# EasyEDA Pro project 读卡器V1.0.eprj

# Schematic Schematic1
Create Date: 2023-06-12; Page Name: P1; Project Name: 读卡器V1.0; Schematic Name: Schematic1; Update Date: 2023-06-30
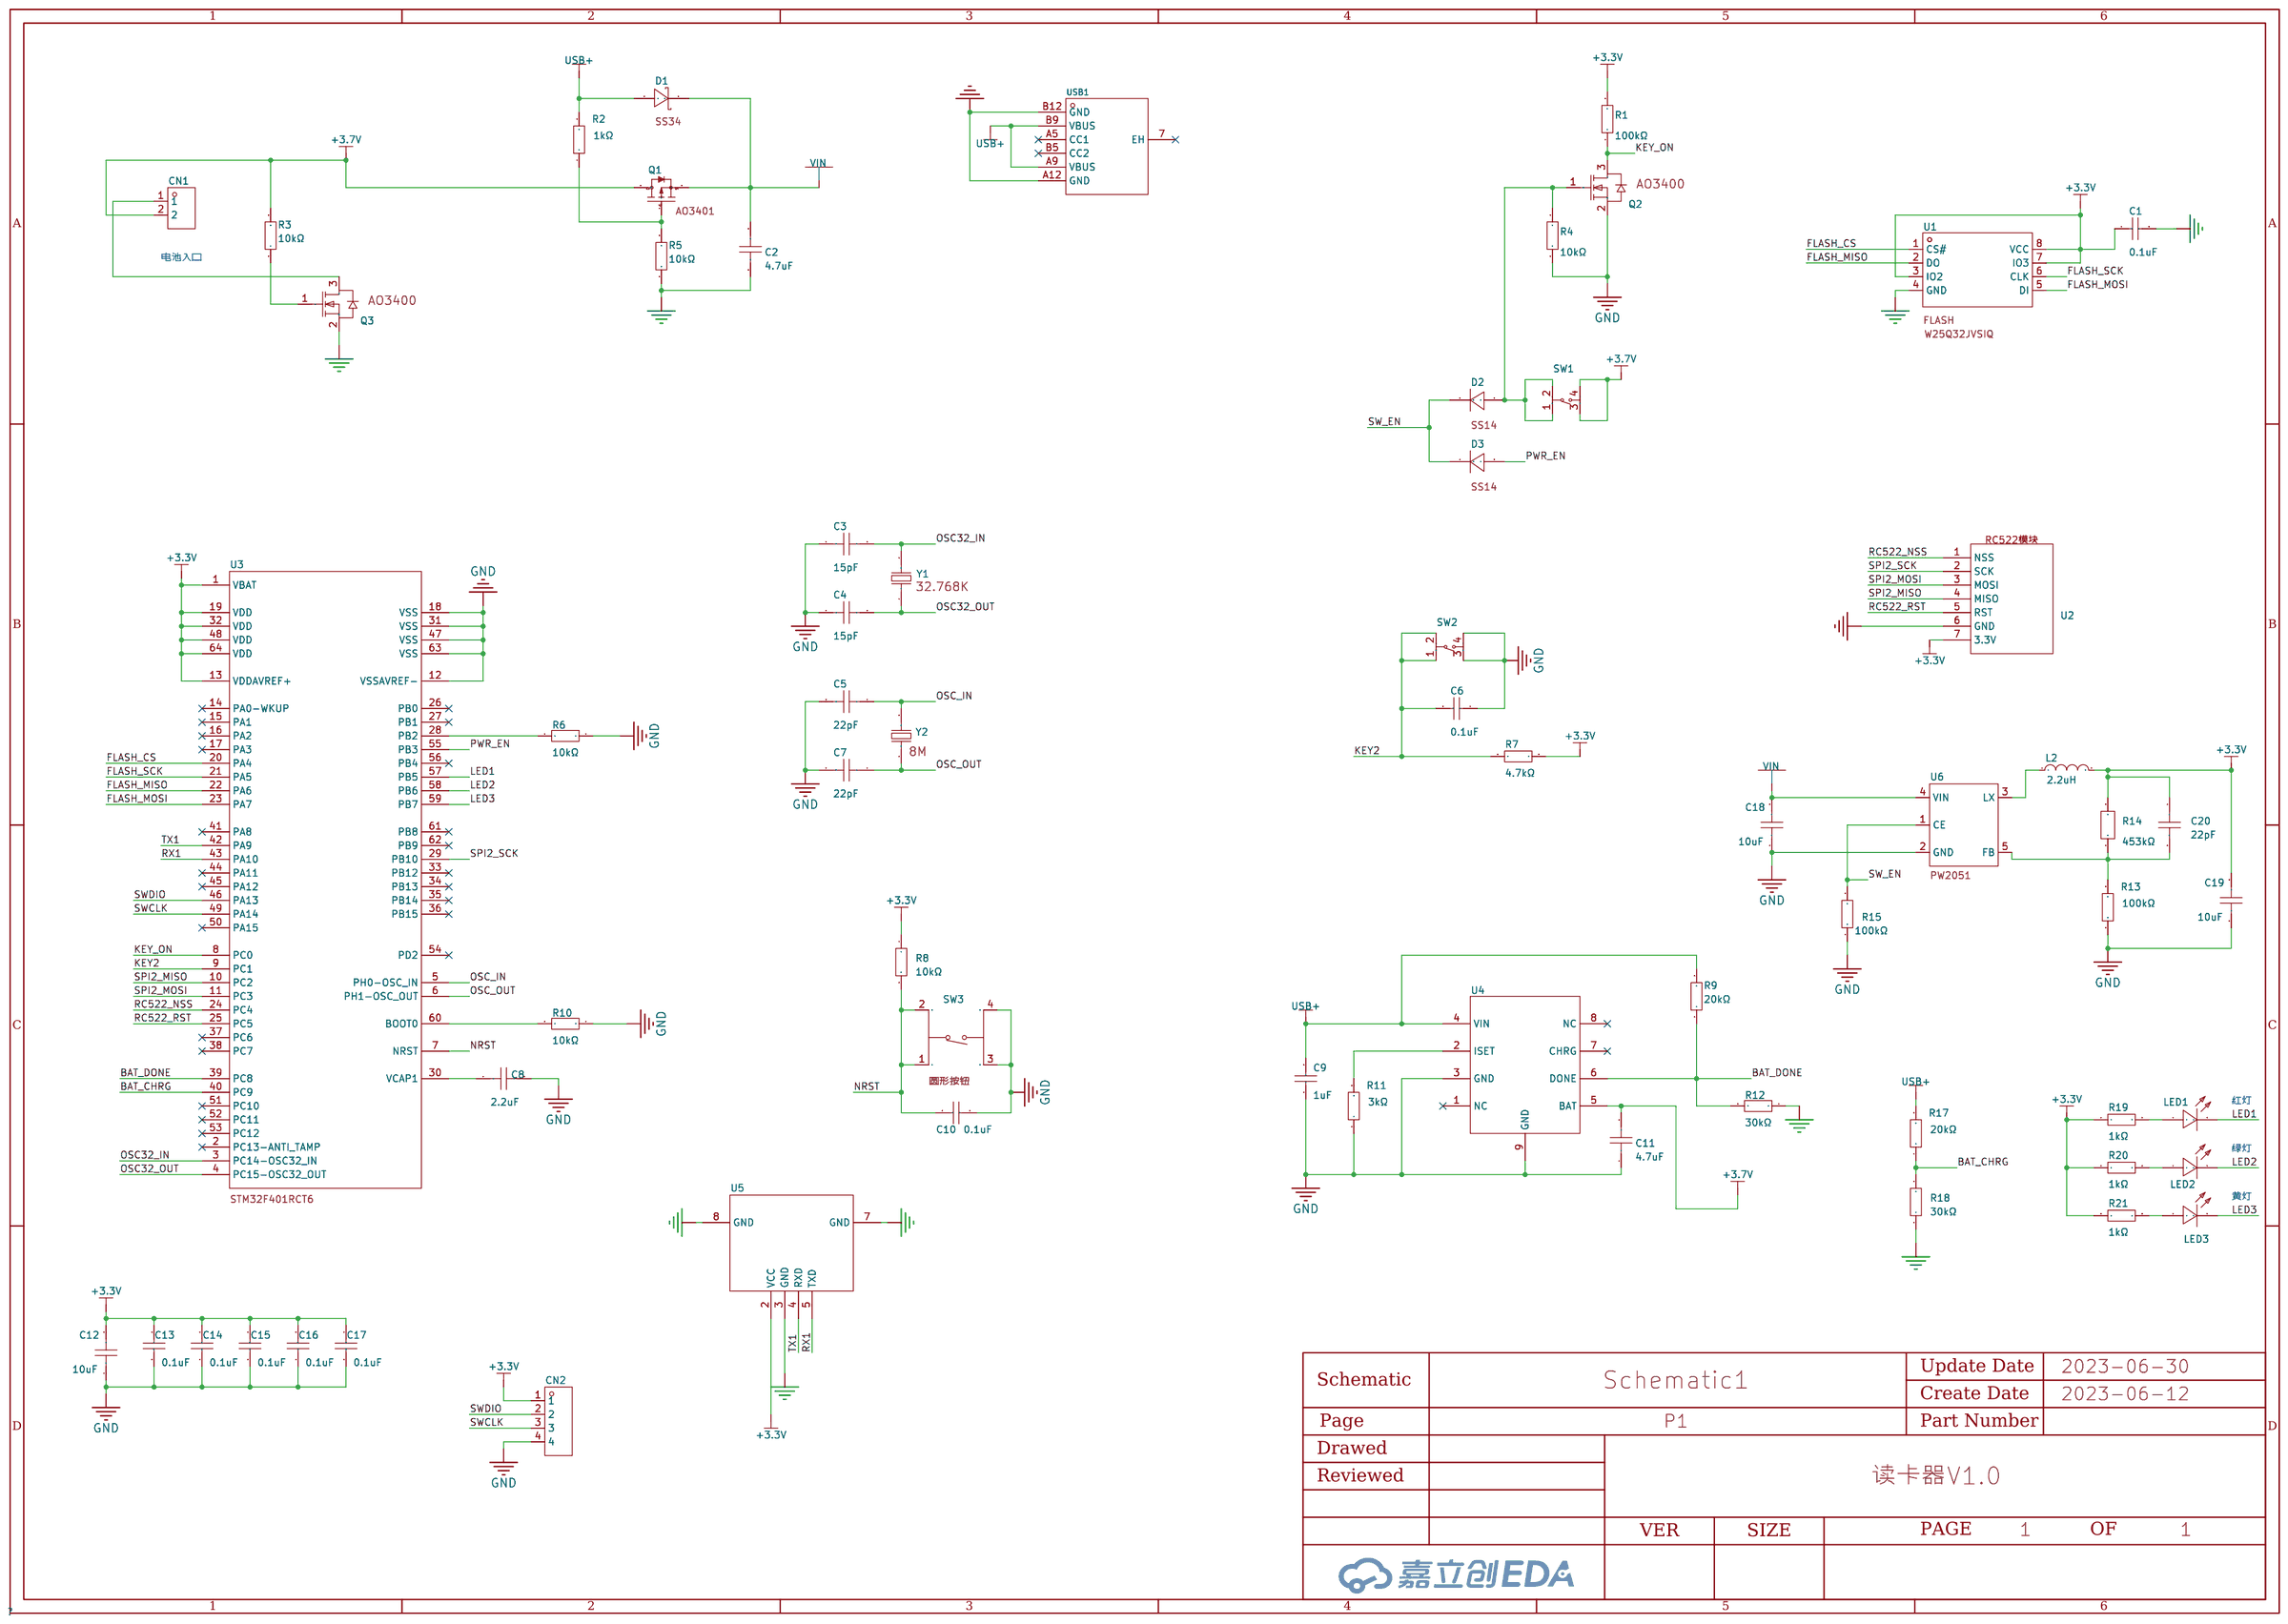
[diagram p0: schematic sheet]

## Parts
C1  0.1uF  [C0603]
C2  4.7uF  [C0603]
C3  15pF  [C0603]
C4  15pF  [C0603]
C5  22pF  [C0603]
C6  0.1uF  [C0603]
C7  22pF  [C0603]
C8  2.2uF  [C0603]
C9  1uF  [C0603]
C10  0.1uF  [C0603]
C11  4.7uF  [C0603]
C12  10uF  [C0603]
C13  0.1uF  [C0603]
C14  0.1uF  [C0603]
C15  0.1uF  [C0603]
C16  0.1uF  [C0603]
C17  0.1uF  [C0603]
C18  10uF  [C0603]
C19  10uF  [C0603]
C20  22pF  [C0603]
CN1  HDGC2501WR-2P  [CONN-TH_2P-P2.50_HDGC2501WR-2P]
CN2  1125-1104G0R138C002  [HDR-TH_4P-P2.54-H-M-W9.4]
D1  -  [DO-214AC_L4.3-W2.7-LS5.3-RD]
D2  SS14  [SMA_L4.3-W2.6-LS5.2-RD]
D3  SS14  [SMA_L4.3-W2.6-LS5.2-RD]
L2  2.2uH  [IND-SMD_L4.0-W4.0_0.47UH04209.5A]
LED1  TLMG1100-GS08  [LED0603-R-RD_GREEN]
LED2  TLMG1100-GS08  [LED0603-R-RD_GREEN]
LED3  TLMG1100-GS08  [LED0603-R-RD_GREEN]
Q1  -  [SOT-23-3_L2.9-W1.3-P1.90-LS2.4-BR]
Q2  AO3400  [SOT-23_L2.9-W1.3-P1.90-LS2.4-BR]
Q3  AO3400  [SOT-23_L2.9-W1.3-P1.90-LS2.4-BR]
R1  100kΩ  [R0603]
R2  1kΩ  [R0603]
R3  10kΩ  [R0603]
R4  10kΩ  [R0603]
R5  10kΩ  [R0603]
R6  10kΩ  [R0603]
R7  4.7kΩ  [R0603]
R8  10kΩ  [R0603]
R9  20kΩ  [R0603]
R10  10kΩ  [R0603]
R11  3kΩ  [R0603]
R12  30kΩ  [R0603]
R13  100kΩ  [R0603]
R14  453kΩ  [R0603]
R15  100kΩ  [R0603]
R17  20kΩ  [R0603]
R18  30kΩ  [R0603]
R19  1kΩ  [R0603]
R20  1kΩ  [R0603]
R21  1kΩ  [R0603]
SW1  -  [按钮开关]
SW2  -  [按钮开关]
SW3  1TS001G-2700-1500-CT  [SW-SMD_4P-L5.1-W5.1-P3.70-LS6.5-TL-2]
U1  -  [SOIC-8_L5.3-W5.3-P1.27-LS8.0-BL]
U2  -  [MFRC522mini]
U3  STM32F401RCT6  [LQFP-64_L10.0-W10.0-P0.50-LS12.0-BL]
U4  -  [PW4056]
U5  -  [GC2400-TC010R]
U6  -  [PW2051]
USB1  TYPE-C 6P(073)  [TYPE-C-SMD_TYPE-C-6P]
Y1  -  [3215]
Y2  -  [5032]

## Library data of the parts
C1 C6 C10 C13-C17 = 0603B104K101CT: 容值:100nF;精度:±10%;额定电压:100V;温度系数:X7R;; LCSC Part Name: 100nF ±10% 100V; Supplier Part: C116838; Manufacturer: 华新科(Walsin); Supplier Footprint: 0603; JLCPCB Part Class: Extended Part; Datasheet: https://atta.szlcsc.com/upload/public/pdf/source/20190709/C116838_F1A9F4B47B8E555AD45D8607B90A094B.pdf; Supplier: LCSC; Tolerance: ±10%; Voltage Rated: 100V; Temperature Coefficient: X7R
C2 C11 = 0603X475M160NT: 容值:4.7uF;精度:±20%;额定电压:16V;温度系数:X5R;; LCSC Part Name: 4.7uF ±20% 16V; Supplier Part: C417282; Manufacturer: FH(风华); Supplier Footprint: 0603; JLCPCB Part Class: Extended Part; Datasheet: https://atta.szlcsc.com/upload/public/pdf/source/20190828/C417282_9FA89336CC150C49D68906F9E844F6E8.pdf; Supplier: LCSC; Tolerance: ±20%; Voltage Rated: 16V; Temperature Coefficient: X5R
C3 C4 = 0603CG150J500NT: 容值:15pF;精度:±5%;额定电压:50V;温度系数:C0G;; LCSC Part Name: 15pF ±5% 50V; Supplier Part: C91703; Manufacturer: FH(风华); Supplier Footprint: 0603; JLCPCB Part Class: Extended Part; Datasheet: https://atta.szlcsc.com/upload/public/pdf/source/20170105/1483610779016.pdf; Supplier: LCSC; Tolerance: ±5%; Voltage Rated: 50V; Temperature Coefficient: C0G
C5 C7 C20 = 0603CG220F500NT: 容值:22pF;精度:±1%;额定电压:50V;温度系数:C0G;; LCSC Part Name: 22pF ±1% 50V; Supplier Part: C190086; Manufacturer: FH(风华); Supplier Footprint: 0603; JLCPCB Part Class: Extended Part; Datasheet: https://atta.szlcsc.com/upload/public/pdf/source/20180403/C190086_AE2857A36C77ED36CE0DF753AD1C79C3.pdf; Supplier: LCSC; Tolerance: ±1%; Voltage Rated: 50V; Temperature Coefficient: C0G
C8 = 0603B225K160CT: 容值:2.2uF;精度:±10%;额定电压:16V;温度系数:X7R;; LCSC Part Name: 2.2uF ±10% 16V; Supplier Part: C525501; Manufacturer: 华新科(Walsin); Supplier Footprint: 0603; JLCPCB Part Class: Extended Part; Datasheet: https://atta.szlcsc.com/upload/public/pdf/source/20191217/C469650_84AD5C6F618CF4AC0C6D987F2E8FE6F8.pdf; Supplier: LCSC; Tolerance: ±10%; Voltage Rated: 16V; Temperature Coefficient: X7R
C9 = 0603F105M250NT: 容值:1uF;精度:±20%;额定电压:25V;温度系数:Y5V;; LCSC Part Name: 1uF ±20% 25V; Supplier Part: C36577; Manufacturer: FH(风华); Supplier Footprint: 0603; JLCPCB Part Class: Extended Part; Datasheet: https://atta.szlcsc.com/upload/public/pdf/source/20170923/C36577_1506149443286988738.pdf; Supplier: LCSC; Tolerance: ±20%; Voltage Rated: 25V; Temperature Coefficient: Y5V
C12 C18 C19 = 0603X106M100CT: 容值:10uF;精度:±20%;额定电压:10V;温度系数:X5R;; LCSC Part Name: 10uF ±20% 10V; Supplier Part: C89283; Manufacturer: 华新科(Walsin); Supplier Footprint: 0603; JLCPCB Part Class: Extended Part; Datasheet: https://atta.szlcsc.com/upload/public/pdf/source/20161226/1482720147964.pdf; Supplier: LCSC; Tolerance: ±20%; Voltage Rated: 10V; Temperature Coefficient: X5R
CN1 = HDGC2501WR-2P: LCSC Part Name: XH2.5弯针 2P; Supplier Part: C5175255; Manufacturer: HDGC(华德共创); Supplier Footprint: 弯插,P=2.5mm; JLCPCB Part Class: Extended Part; Datasheet: https://atta.szlcsc.com/upload/public/pdf/source/20220916/C1717F8E2C78083BF9D63A459D48AEE1.pdf; Supplier: LCSC
CN2 = 1125-1104G0R138C002: 排数:单排;总PIN位数:4;间距:2.54mm;插针结构:1x4P;行距:2.54mm;安装类型:弯插;圆针/方针:方针;额定电流:3A;额定电压:320V;配合针长度:6mm;塑高:2.5mm;端接针长度:-;触头材质:黄铜;触头镀层:金;工作温度范围:-40~+105;颜色:黑色;; LCSC Part Name: 2.54mm 1x4P 弯插 方针; Supplier Part: C721443; Manufacturer: Wcon(维峰电子); Supplier Footprint: 弯插,P=2.54mm; JLCPCB Part Class: Extended Part; Datasheet: https://atta.szlcsc.com/upload/public/pdf/source/20200817/C721441_9C294CE567E7CA2BF1A06D224BABC3D8.pdf; Supplier: LCSC; Number of Rows: 单排; Number of Pins: 4; Pitch: 2.54mm; Pin Structure: 1x4P; Row Spacing: 2.54mm; Mounting Type: 弯插; Circluar Pins/Square Pins: 方针; Current Rating (Max): 3A; Voltage Rating (Max): 320V; Length of Mating Pin: 6mm; Insulation Height: 2.5mm; Contact Material: 黄铜; Contact Plating: 金; Operating Temperature Range: -40~+105; Color: 黑色
D1 = SS34_C8678: 直流反向耐压(Vr):40V;平均整流电流(Io):3A;正向压降(Vf):550mV@3A;; LCSC Part Name: 40V 3A 550mV@3A; Supplier Part: C8678; Manufacturer: MDD; Manufacturer Part: SS34; Supplier Footprint: SMA(DO-214AC); JLCPCB Part Class: Basic Part; Datasheet: https://atta.szlcsc.com/upload/public/pdf/source/20210506/C15874_5BDBC70F665BA444FCE0210303DB2A89.pdf; Supplier: LCSC; Reverse Voltage (Vr): 40V; Average Rectified Current (Io): 3A; Forward Voltage (Vf@If): 550mV@3A
D2 D3 = SS14A: 直流反向耐压(Vr):40V;平均整流电流(Io):1A;正向压降(Vf):500mV@1A;; LCSC Part Name: 40V 1A 500mV@1A; Supplier Part: C211770; Manufacturer: YANGJIE(扬杰); Supplier Footprint: SMA(DO-214AC); JLCPCB Part Class: Extended Part; Datasheet: https://atta.szlcsc.com/upload/public/pdf/source/20180504/C211770_627C435F34E9C107E4A4301F69D28675.pdf; Supplier: LCSC; Reverse Voltage (Vr): 40V; Average Rectified Current (Io): 1A; Forward Voltage (Vf@If): 500mV@1A
L2 = 2.2uh3a电感: 电感值:2.2uH;精度:±20%;额定电流:3A;直流电阻(DCR):-;; Rated Current: 3A; Supplier: LCSC; Supplier Part: C438930; Supplier Footprint: SMD; LCSC Part Name: 2.2uH ±20% 3A; Tolerance: ±20%; Manufacturer: Cybermax(思博科技); Manufacturer Part: CMLO0420H2R2MTT
LED1-LED3 = TLMG1100-GS08: 照明颜色:普绿/黄绿;色温 - CCT（K）:-;主波长/色坐标:570nm;; LCSC Part Name: 普绿/黄绿 0603; Supplier Part: C241891; Manufacturer: VISHAY(威世); Supplier Footprint: 0603; JLCPCB Part Class: Extended Part; Datasheet: https://atta.szlcsc.com/upload/public/pdf/source/20180719/C241891_3C76D4DD30CDE57601F75DEAAAECA69D.pdf; Supplier: LCSC; Mounting Type: 表面贴装; Illumination Color: 普绿/黄绿; Luminous Intensity (IF=20mA): 35mcd; Dominant Wavelength / Coordinate rank: 570nm
Q1 = AO3401_C181091: 类型:P沟道;漏源电压(Vdss):30V;连续漏极电流(Id):4.2A;功率(Pd):350mW;导通电阻(RDS(on)@Vgs,Id):65mΩ@10V,4.2A;阈值电压(Vgs(th)@Id):1.3V@250A;; LCSC Part Name: P沟道 30V 4.2A; Supplier Part: C181091; Manufacturer: Hottech(合科泰); Manufacturer Part: AO3401; Supplier Footprint: SOT-23(SOT-23-3); JLCPCB Part Class: Extended Part; Datasheet: https://atta.szlcsc.com/upload/public/pdf/source/20180131/C181091_15173931948391329220.pdf; Supplier: LCSC; Type: P沟道; Drain Source Voltage (Vdss): 30V; Continuous Drain Current (Id): 4.2A; Power Dissipation (Pd): 350mW; Drain Source On Resistance (RDS(on)@Vgs,Id): 65mΩ@10V,4.2A; Gate Threshold Voltage (Vgs(th)@Id): 1.3V@250A
Q2 Q3 = AO3400: 类型:N沟道;漏源电压(Vdss):30V;连续漏极电流(Id):5.8A;功率(Pd):1.5W;导通电阻(RDS(on)@Vgs,Id):35mΩ@10V,5.8A;阈值电压(Vgs(th)@Id):1.2V@250uA;栅极电荷(Qg@Vgs):-;输入电容(Ciss@Vds):1050pF@15V;反向传输电容(Crss@Vds):77pF@15V;工作温度:+150@(Tj);; LCSC Part Name: N沟道 30V 5.8A; Supplier Part: C2938367; Manufacturer: GOODWORK(固得沃克); Supplier Footprint: SOT23; JLCPCB Part Class: Extended Part; Datasheet: https://atta.szlcsc.com/upload/public/pdf/source/20211229/1DE691E24B5B31BB262C463D0489A9AB.pdf; Supplier: LCSC; Type: N沟道; Drain Source Voltage (Vdss): 30V; Continuous Drain Current (Id): 5.8A; Power Dissipation (Pd): 1.5W; Drain Source On Resistance (RDS(on)@Vgs,Id): 35mΩ@10V,5.8A; Gate Threshold Voltage (Vgs(th)@Id): 1.2V@250uA; Input Capacitance (Ciss@Vds): 1050pF@15V; Reverse Transfer Capacitance (Crss@Vds): 77pF@15V; Operating Temperature: +150@(Tj)
R1 = MCT06030C1003FP500: 电阻类型:薄膜电阻;阻值:100kΩ;精度:±1%;功率:100mW;温度系数:±50ppm/K;最大工作电压:75V;工作温度范围:-55~+125;; LCSC Part Name: 100kΩ ±1%; Supplier Part: C161805; Manufacturer: VISHAY(威世); Supplier Footprint: 0603; JLCPCB Part Class: Extended Part; Datasheet: https://atta.szlcsc.com/upload/public/pdf/source/20180125/C161805_15168649470331302834.pdf; Supplier: LCSC; Type: 薄膜电阻; Tolerance: ±1%; Power(Watts): 100mW; Temperature Coefficient: ±50ppm/K; Overload Voltage (Max): 75V; Operating Temperature Range: -55~+125
R2 = TR0603B1K00P0525Z: 电阻类型:薄膜电阻;阻值:1kΩ;精度:±0.1%;功率:100mW;温度系数:±25ppm/;最大工作电压:75V;工作温度范围:-55~+155;; LCSC Part Name: 1kΩ ±0.1%; Supplier Part: C188364; Manufacturer: EVER OHMS(天二科技); Supplier Footprint: 0603; JLCPCB Part Class: Extended Part; Datasheet: https://atta.szlcsc.com/upload/public/pdf/source/20190415/C188364_2560310032FA915A7069B8237DA8774F.pdf; Supplier: LCSC; Type: 薄膜电阻; Tolerance: ±0.1%; Power(Watts): 100mW; Temperature Coefficient: ±25ppm/; Overload Voltage (Max): 75V; Operating Temperature Range: -55~+155
R3-R6 R8 R10 = SY0603JN10KP: 阻值:10kΩ;精度:±5%;功率:1/16W;温度系数:±100ppm/;; LCSC Part Name: 10kΩ ±5%; Supplier Part: C380762; Manufacturer: SANYEAR(叁叶源); Supplier Footprint: 0603; JLCPCB Part Class: Extended Part; Datasheet: https://atta.szlcsc.com/upload/public/pdf/source/20190402/C380762_D09B63EB8DF4AE0F44268631C04132BC.pdf; Supplier: LCSC; Tolerance: ±5%; Power(Watts): 1/16W; Temperature Coefficient: ±100ppm/
R7 = RMC 0603 4K7 F N: 阻值:4.7kΩ;精度:±1%;功率:0.1W;; LCSC Part Name: 4.7kΩ ±1%; Supplier Part: C269713; Manufacturer: Tyohm(幸亚电阻); Supplier Footprint: 0603; JLCPCB Part Class: Extended Part; Datasheet: https://atta.szlcsc.com/upload/public/pdf/source/20190115/C269713_06B12CBF45628C37C65359B185ED7F9D.pdf; Supplier: LCSC; Tolerance: ±1%; Power(Watts): 0.1W
R9 = RC0603DR-0720KL: 电阻类型:厚膜电阻;阻值:20kΩ;精度:±0.5%;功率:100mW;温度系数:±100ppm/;最大工作电压:75V;工作温度范围:-55~+155;; LCSC Part Name: 20kΩ ±0.5%; Supplier Part: C137817; Manufacturer: YAGEO(国巨); Supplier Footprint: 0603; JLCPCB Part Class: Extended Part; Datasheet: https://atta.szlcsc.com/upload/public/pdf/source/20171106/C137817_15099606819651093946.pdf; Supplier: LCSC; Type: 厚膜电阻; Tolerance: ±0.5%; Power(Watts): 100mW; Temperature Coefficient: ±100ppm/; Overload Voltage (Max): 75V; Operating Temperature Range: -55~+155
R11 = 0603WAJ0302T5E: 电阻类型:厚膜电阻;阻值:3kΩ;精度:±5%;功率:1/10W;温度系数:±100ppm/;最大工作电压:75V;工作温度范围:-55~+155;; LCSC Part Name: 3kΩ ±5%; Supplier Part: C25597; Manufacturer: UNI-ROYAL(厚声); Supplier Footprint: 0603; JLCPCB Part Class: Extended Part; Datasheet: https://atta.szlcsc.com/upload/public/pdf/source/20200306/C422600_1E6D84923E4A46A82E41ADD87F860B5C.pdf; Supplier: LCSC; Type: 厚膜电阻; Tolerance: ±5%; Power(Watts): 1/10W; Temperature Coefficient: ±100ppm/; Overload Voltage (Max): 75V; Operating Temperature Range: -55~+155
R12 = AC0603FR-0730KL: 电阻类型:厚膜电阻;阻值:30kΩ;精度:±1%;功率:100mW;温度系数:±100ppm/;最大工作电压:75V;工作温度范围:-55~+155;; LCSC Part Name: 30kΩ ±1%; Supplier Part: C144670; Manufacturer: YAGEO(国巨); Supplier Footprint: 0603; JLCPCB Part Class: Extended Part; Datasheet: https://atta.szlcsc.com/upload/public/pdf/source/20171225/C144670_15141880418861202957.pdf; Supplier: LCSC; Type: 厚膜电阻; Tolerance: ±1%; Power(Watts): 100mW; Temperature Coefficient: ±100ppm/; Overload Voltage (Max): 75V; Operating Temperature Range: -55~+155
R13 R15 = 0603WAF1003T5E: 电阻类型:厚膜电阻;阻值:100kΩ;精度:±1%;功率:100mW;; LCSC Part Name: 100kΩ ±1% 100mW; Supplier Part: C25803; Manufacturer: UNI-ROYAL(厚声); Supplier Footprint: 0603; JLCPCB Part Class: Basic Part; Datasheet: https://atta.szlcsc.com/upload/public/pdf/source/20200306/C422600_1E6D84923E4A46A82E41ADD87F860B5C.pdf; Supplier: LCSC; Type: 厚膜电阻; Tolerance: ±1%; Power(Watts): 100mW; Temperature Coefficient: ±100ppm/; Overload Voltage (Max): 75V; Operating Temperature Range: -55~+155
R14 = RC0603FR-07453KL: 电阻类型:厚膜电阻;阻值:453kΩ;精度:±1%;功率:100mW;; LCSC Part Name: 453kΩ ±1% 100mW; Supplier Part: C273765; Manufacturer: YAGEO(国巨); Supplier Footprint: 0603; JLCPCB Part Class: Extended Part; Datasheet: https://atta.szlcsc.com/upload/public/pdf/source/20191125/C273765_7C421A3A285B90E1F65B5105C399ED72.pdf; Supplier: LCSC; Type: 厚膜电阻; Tolerance: ±1%; Power(Watts): 100mW; Temperature Coefficient: ±100ppm/; Overload Voltage (Max): 75V; Operating Temperature Range: -55~+155
R17 = 0603WAF2002T5E: 电阻类型:厚膜电阻;阻值:20kΩ;精度:±1%;功率:100mW;; LCSC Part Name: 20kΩ ±1% 100mW; Supplier Part: C4184; Manufacturer: UNI-ROYAL(厚声); Supplier Footprint: 0603; JLCPCB Part Class: Basic Part; Datasheet: https://atta.szlcsc.com/upload/public/pdf/source/20200306/C422600_1E6D84923E4A46A82E41ADD87F860B5C.pdf; Supplier: LCSC; Type: 厚膜电阻; Tolerance: ±1%; Power(Watts): 100mW; Temperature Coefficient: ±100ppm/; Overload Voltage (Max): 75V; Operating Temperature Range: -55~+155
R18 = 0603WAF3002T5E: 电阻类型:厚膜电阻;阻值:30kΩ;精度:±1%;功率:100mW;; LCSC Part Name: 30kΩ ±1% 100mW; Supplier Part: C22984; Manufacturer: UNI-ROYAL(厚声); Supplier Footprint: 0603; JLCPCB Part Class: Basic Part; Datasheet: https://atta.szlcsc.com/upload/public/pdf/source/20200306/C422600_1E6D84923E4A46A82E41ADD87F860B5C.pdf; Supplier: LCSC; Type: 厚膜电阻; Tolerance: ±1%; Power(Watts): 100mW; Temperature Coefficient: ±100ppm/; Overload Voltage (Max): 75V; Operating Temperature Range: -55~+155
R19-R21 = 0603WAF5100T5E: 电阻类型:厚膜电阻;阻值:510Ω;精度:±1%;功率:100mW;; LCSC Part Name: 510Ω ±1% 100mW; Supplier Part: C23193; Manufacturer: UNI-ROYAL(厚声); Supplier Footprint: 0603; JLCPCB Part Class: Basic Part; Datasheet: https://atta.szlcsc.com/upload/public/pdf/source/20200306/C422600_1E6D84923E4A46A82E41ADD87F860B5C.pdf; Supplier: LCSC; Type: 厚膜电阻; Tolerance: ±1%; Power(Watts): 100mW; Temperature Coefficient: ±100ppm/; Overload Voltage (Max): 75V; Operating Temperature Range: -55~+155
SW1 SW2 = 按键开关
SW3 = 1TS001G-2700-1500-CT: 触点电流:20mA;额定电压(DC):12V;电路结构:单刀单掷;安装方式:立贴;按钮形状:圆形按钮;带灯:-;开关长度:5.1mm;开关宽度:5.1mm;开关高度:0.3mm;; LCSC Part Name: 铜头按钮; Supplier Part: C318800; Manufacturer: HYP(鸿源精密); Supplier Footprint: SMD,5.1x5.1mm; JLCPCB Part Class: Extended Part; Datasheet: https://atta.szlcsc.com/upload/public/pdf/source/20200109/C318800_E3EE45BECD3EEEC6701309AC007B685B.pdf; Supplier: LCSC; Contact Current: 20mA; Voltage Rating (DC): 12V; Circuit: 单刀单掷; Mounting Style: 立贴; Actuator Style: 圆形按钮; Switch Length: 5.1mm; Switch Width: 5.1mm; Switch Height: 0.3mm
U1 = W25Q128JVSIQ: 存储器类型:Non-Volatile;存储器构架(格式):FLASH;存储器容量:128Mb (16M x 8);存储器接口类型:SPI - Dual/Quad I/O;; LCSC Part Name: W25Q32JVSIQ; Supplier Part: C97521; Manufacturer: WINBOND(华邦); Supplier Footprint: SOIC-8_208mil; JLCPCB Part Class: Basic Part; Datasheet: https://atta.szlcsc.com/upload/public/pdf/source/20170316/1489627409956.pdf; Supplier: LCSC; Memory Type: Non-Volatile; Memory Format: FLASH; Memory Size: 128Mb (16M x 8); Memory Interface: SPI - Dual/Quad I/O; Voltage - Supply: 2.7V ~ 3.6V
U2 = MFRC522mini
U3 = STM32F401RCT6: 主频（MAX):84MHz;工作电压:1.7V ~ 3.6V;; Supplier Part: C74524; Manufacturer: ST(意法半导体); Supplier Footprint: LQFP-64_10x10x05P; JLCPCB Part Class: Extended Part; Datasheet: https://atta.szlcsc.com/upload/public/pdf/source/20170728/C74524_1501225886278849063.pdf; Supplier: LCSC; Speed: 84MHz; Voltage - Supply (Vcc/Vdd): 1.7V ~ 3.6V; Program Memory Size: 256KB; RAM Size: 64KB; Number of I/O: 50; A/D: 16x12bit; PWM: 32; UART/USART: 3 USART; SPI: 3; I2C（SMBUS/PMBUS）: 2; USB Device: 1; USB Host/OTG: 1
U4 = PW4056: 带OVP充电芯片
U5 = GC2400-TC010R: 无线模块; NO_CONNECT: yes
U6 = PW2051: Supplier: LCSC; Supplier Part: C9900004763; Supplier Footprint: SOT23-5; JLCPCB Part Class: Extended Part; Datasheet: 2021-12-24/856123Z/fbe1facec1e64a42b88c21fe7c936e8d/PW2051.pdf
USB1 = TYPE-C 6P(073): 连接器类型:Type-C;标准:-;公母:母座;触点数量:6P;端口数量:1;安装方式:卧贴;额定电流 - 电源:5A;工作温度范围:-25~+85;; LCSC Part Name: Type-C 母座 卧贴; Supplier Part: C668623; Manufacturer: SHOU HAN(首韩); Supplier Footprint: SMD; JLCPCB Part Class: Extended Part; Datasheet: https://atta.szlcsc.com/upload/public/pdf/source/20200618/C668623_A4B260DED7AC1949BAC6AE39E9F4CD80.pdf; Supplier: LCSC; Connector Type: Type-C; Gender: 母座; Number of Contacts: 6P; Number of Ports: 1; Mounting Style: 卧贴; Current Rating - Power (Max): 5A; Operating Temperature Range: -25~+85
Y1 = 32.768KHz晶振: Frequency: 32.768K
Y2 = 8MHz晶振: Capacitance: 8M

## Nets
+3.3V: C1.1 C12.2 C13.2 C14.2 C15.2 C16.2 C17.2 C19.2 C20.1 CN2.1 L2.2 R1.2 R7.2 R8.1 R14.2 R19.1 R20.1 R21.1 U1.3(IO2) U1.7(IO3) U1.8(VCC) U2.7(3.3V) U3.1(VBAT) U3.13(VDDAVREF+) U3.19(VDD) U3.32(VDD) U3.48(VDD) U3.64(VDD) U5.2(VCC)
+3.7V: C11.2 CN1.2 Q1.3(D) R3.2 SW1.3(C) SW1.4(D) U4.5(BAT)
GND: C1.2 C2.1 C3.1 C4.1 C5.2 C6.1 C7.2 C8.2 C9.1 C10.1 C11.1 C12.1 C13.1 C14.1 C15.1 C16.1 C17.1 C18.1 C19.1 CN2.4 Q2.2(S) Q3.2(S) R4.2 R5.1 R6.1 R10.1 R11.1 R12.1 R13.1 R15.1 R18.1 SW2.3(C) SW2.4(D) SW3.3(C) SW3.4(D) U1.4(GND) U2.6(GND) U3.12(VSSAVREF-) U3.18(VSS) U3.31(VSS) U3.47(VSS) U3.63(VSS) U4.3(GND) U4.9(GND) U5.3(GND) U5.7(GND) U5.8(GND) U6.2(GND) USB1.A12(GND) USB1.B12(GND)
VIN: C2.2 C18.2 D1.1(K) Q1.2(S) U6.4(VIN)
BAT_CHRG: R17.1 R18.2 U3.40(PC9)
BAT_DONE: R9.1 R12.2 U3.39(PC8) U4.6(DONE)
FLASH_CS: U1.1(CS#) U3.20(PA4)
FLASH_MISO: U1.2(DO) U3.22(PA6)
FLASH_MOSI: U1.5(DI) U3.23(PA7)
FLASH_SCK: U1.6(CLK) U3.21(PA5)
KEY2: C6.2 R7.1 SW2.1(A) SW2.2(B) U3.9(PC1)
KEY_ON: Q2.3(D) R1.1 U3.8(PC0)
LED1: LED1.2(K) U3.57(PB5)
LED2: LED2.2(K) U3.58(PB6)
LED3: LED3.2(K) U3.59(PB7)
NRST: C10.2 R8.2 SW3.1(A) SW3.2(B) U3.7(NRST)
OSC32_IN: C3.2 U3.3(PC14-OSC32_IN) Y1.2
OSC32_OUT: C4.2 U3.4(PC15-OSC32_OUT) Y1.1
OSC_IN: C5.1 U3.5(PH0-OSC_IN) Y2.2
OSC_OUT: C7.1 U3.6(PH1-OSC_OUT) Y2.1
PWR_EN: D3.2(A) U3.55(PB3)
RC522_NSS: U2.1(NSS) U3.24(PC4)
RC522_RST: U2.5(RST) U3.25(PC5)
RX1: U3.43(PA10) U5.5(TXD)
SPI2_MISO: U2.4(MISO) U3.10(PC2)
SPI2_MOSI: U2.3(MOSI) U3.11(PC3)
SPI2_SCK: U2.2(SCK) U3.29(PB10)
SW_EN: D2.1(C) D3.1(C) R15.2 U6.1(CE)
SWCLK: CN2.3 U3.49(PA14)
SWDIO: CN2.2 U3.46(PA13)
TX1: U3.42(PA9) U5.4(RXD)
USB+: C9.2 D1.2(A) R2.2 R9.2 R17.2 U4.4(VIN) USB1.A9(VBUS) USB1.B9(VBUS)
$1N1057: C8.1 U3.30(VCAP1)
$1N1061: R10.2 U3.60(BOOT0)
$1N1063: R6.2 U3.28(PB2)
$1N4310: Q1.1(G) R2.1 R5.2
$1N4312: Q3.1(G) R3.1
$1N4317: CN1.1 Q3.3(D)
$1N5240: D2.2(A) Q2.1(G) R4.1 SW1.1(A) SW1.2(B)
$1N7608: R11.2 U4.2(ISET)
$1N18015: L2.1 U6.3(LX)
$1N18018: C20.2 R13.2 R14.1 U6.5(FB)
$1N20712: LED1.1(A) R19.2
$1N20785: LED2.1(A) R20.2
$1N20858: LED3.1(A) R21.2

Not connected (* = marked no-connect by the designer): U3 2(PC13-ANTI_TAMP)* 14(PA0-WKUP)* 15(PA1)* 16(PA2)* 17(PA3)* 26(PB0)* 27(PB1)* 33(PB12)* 34(PB13)* 35(PB14)* 36(PB15)* 37(PC6)* 38(PC7)* 41(PA8)* 44(PA11)* 45(PA12)* 50(PA15)* 51(PC10)* 52(PC11)* 53(PC12)* 54(PD2)* 56(PB4)* 61(PB8)* 62(PB9)*; U4 1(NC)* 7(CHRG)* 8(NC)*; USB1 7(EH)* A5(CC1)* B5(CC2)*

## Notes on the sheet
- 电池入口
- 红灯
- 绿灯
- 黄灯

# Board PCB1
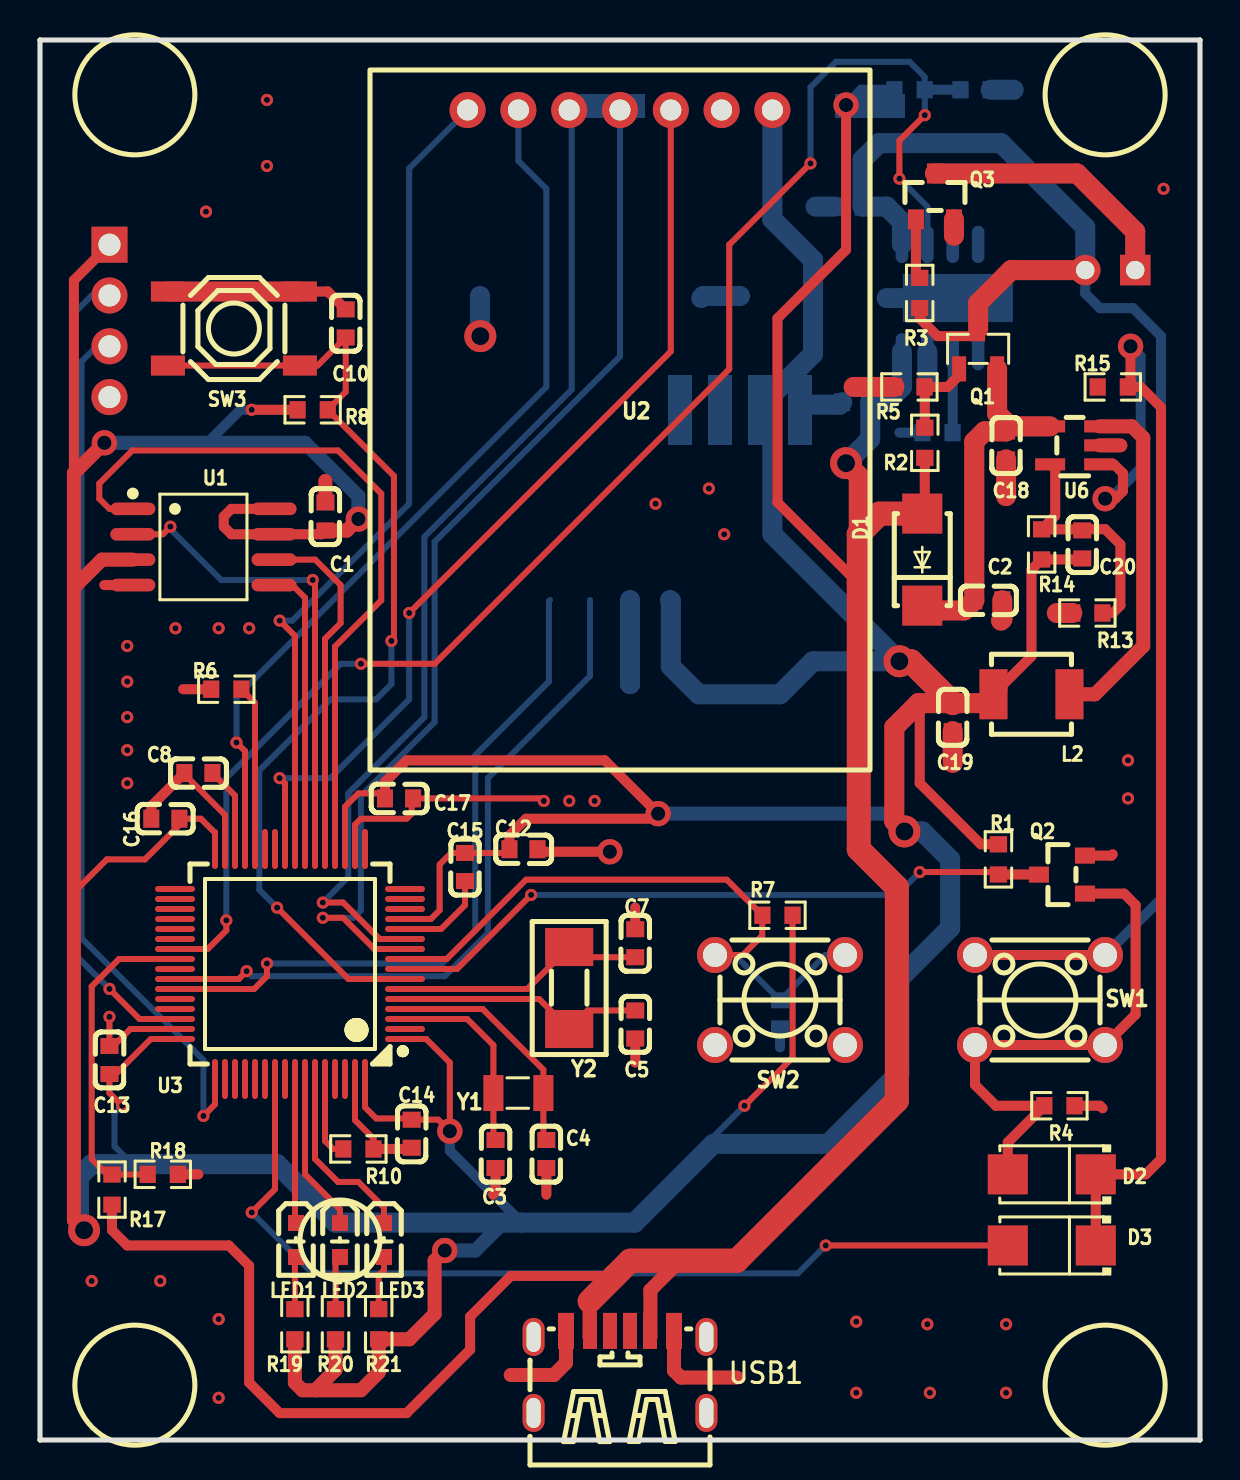
[diagram p1: board, top side]
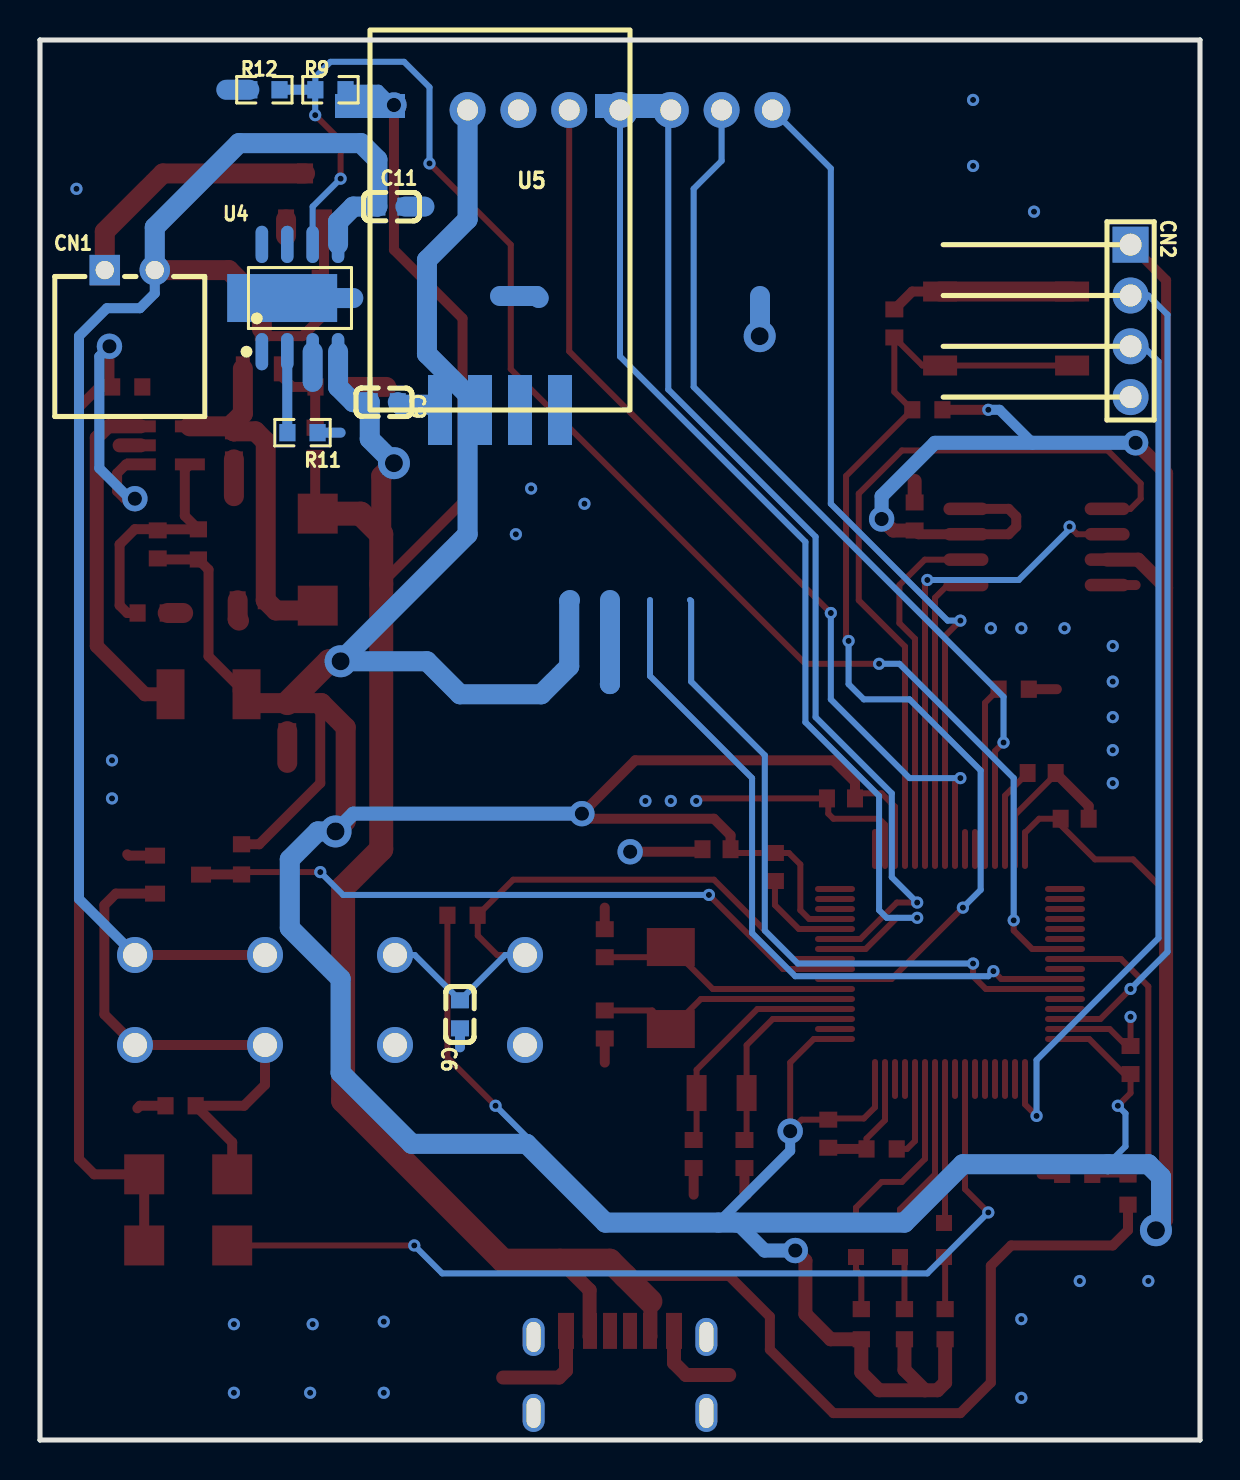
[diagram p2: board, bottom side, seen from below]

Outline 58 x 70 mm; copper layers: Top Layer, Bottom Layer. Coordinates in mm from the lower left corner of the outline.
Outline path: 0,70 0,0 arc(0,0) 0,0 58,0 arc(58,0) 58,0 58,70 arc(58,70) 58,70 0,70 arc(0,70) 0,70
Stack: Top Layer 0.035mm / Dielectric1 1.51mm FR4 er 4.5 / Bottom Layer 0.035mm

## Design rules (mm)
spacing safeClearance (default): track to track 0.152, other pairs 0.152 to 0.3
track width trackWidth (default): min 0.127, default 0.254, max 2.54
differential pair differentialPair (default): width min 0.127, default 0.254, max 2.54; gap min 0.152, default 0.152
via viaSize (default): diameter min 0.5, default 0.61, max 10; hole min 0.3, default 0.305, max 6

## Placement (name value [footprint] x y rotation side)
C1  0.1uF  [C0603]  14.27 46.18 90 top
C2  4.7uF  [C0603]  47.42 41.99 180 top
C3  15pF  [C0603]  22.78 14.3 90 top
C4  15pF  [C0603]  25.32 14.3 90 top
C5  22pF  [C0603]  29.76 20.78 270 top
C6  0.1uF  [C0603]  37 21.28 90 bottom
C7  22pF  [C0603]  29.76 24.84 90 top
C8  2.2uF  [C0603]  7.92 33.35 180 top
C9  1uF  [C0603]  40.81 51.89 0 bottom
C10  0.1uF  [C0603]  15.28 55.83 270 top
C11  4.7uF  [C0603]  40.43 61.67 0 bottom
C12  10uF  [C0603]  24.17 29.54 180 top
C13  0.1uF  [C0603]  3.47 19 270 top
C14  0.1uF  [C0603]  18.59 15.32 90 top
C15  0.1uF  [C0603]  21.25 28.65 90 top
C16  0.1uF  [C0603]  6.27 31.06 0 top
C17  0.1uF  [C0603]  17.95 32.08 180 top
C18  10uF  [C0603]  48.3 49.73 90 top
C19  10uF  [C0603]  45.64 36.14 90 top
C20  22pF  [C0603]  52.11 44.78 90 top
CN1  HDGC2501WR-2P  [CONN-TH_2P-P2.50_HDGC2501WR-2P]  53.51 58.5 180 bottom
CN2  1125-1104G0R138C002  [HDR-TH_4P-P2.54-H-M-W9.4]  3.47 55.96 270 bottom
D1  -  [DO-214AC_L4.3-W2.7-LS5.3-RD]  44.11 44.02 90 top
D2  SS14  [SMA_L4.3-W2.6-LS5.2-RD]  50.59 13.28 180 top
D3  SS14  [SMA_L4.3-W2.6-LS5.2-RD]  50.59 9.73 180 top
L2  2.2uH  [IND-SMD_L4.0-W4.0_0.47UH04209.5A]  49.57 37.29 180 top
LED1  TLMG1100-GS08  [LED0603-R-RD_GREEN]  12.8 10 270 top
LED2  TLMG1100-GS08  [LED0603-R-RD_GREEN]  15 10 270 top
LED3  TLMG1100-GS08  [LED0603-R-RD_GREEN]  17.2 10 270 top
Q1  -  [SOT-23-3_L2.9-W1.3-P1.90-LS2.4-BR]  46.91 54.56 270 top
Q2  AO3400  [SOT-23_L2.9-W1.3-P1.90-LS2.4-BR]  51.1 28.27 0 top
Q3  AO3400  [SOT-23_L2.9-W1.3-P1.90-LS2.4-BR]  44.75 62.18 270 top
R1  100kΩ  [R0603]  47.92 29.03 90 top
R2  1kΩ  [R0603]  44.24 49.86 270 top
R3  10kΩ  [R0603]  43.99 57.35 270 top
R4  10kΩ  [R0603]  50.97 16.71 0 top
R5  10kΩ  [R0603]  43.47 52.65 0 top
R6  10kΩ  [R0603]  9.32 37.54 0 top
R7  4.7kΩ  [R0603]  36.87 26.24 0 top
R8  10kΩ  [R0603]  13.63 51.51 0 top
R9  20kΩ  [R0603]  43.48 67.51 180 bottom
R10  10kΩ  [R0603]  15.92 14.55 180 top
R11  3kΩ  [R0603]  44.88 50.37 0 bottom
R12  30kΩ  [R0603]  46.78 67.51 180 bottom
R13  100kΩ  [R0603]  52.37 41.35 0 top
R14  453kΩ  [R0603]  50.08 44.78 270 top
R15  100kΩ  [R0603]  53.64 52.65 0 top
R17  20kΩ  [R0603]  3.6 12.52 270 top
R18  30kΩ  [R0603]  6.14 13.28 180 top
R19  1kΩ  [R0603]  12.74 5.79 90 top
R20  1kΩ  [R0603]  14.78 5.79 90 top
R21  1kΩ  [R0603]  16.94 5.79 90 top
SW1  -  [按钮开关]  50 22 180 top
SW2  -  [按钮开关]  37 22 0 top
SW3  1TS001G-2700-1500-CT  [SW-SMD_4P-L5.1-W5.1-P3.70-LS6.5-TL-2]  9.7 55.57 180 top
U1  -  [SOIC-8_L5.3-W5.3-P1.27-LS8.0-BL]  8.17 44.65 270 top
U2  -  [MFRC522mini]  29 51 0 top
U3  STM32F401RCT6  [LQFP-64_L10.0-W10.0-P0.50-LS12.0-BL]  12.5 23.8 90 top
U4  -  [PW4056]  45 57.1 180 bottom
U5  -  [GC2400-TC010R]  35 61 180 bottom
U6  -  [PW2051]  51.73 49.73 0 top
USB1  TYPE-C 6P(073)  [TYPE-C-SMD_TYPE-C-6P]  29 3.25 0 top
Y1  -  [3215]  23.92 17.35 180 top
Y2  -  [5032]  26.46 22.55 270 top

## Footprints (pads in the part's own frame, mm; a bottom-side part is the same pattern mirrored in y, then rotated)
3215
  rect 1x1.8 smd: 1(-1.25,0) 2(1.25,0)
5032
  rect 1.9x2.401 smd: 1(-2.093,0) 2(2.007,0)
C0603
  rect 0.8x0.899 smd: 1(-0.701,0) 2(0.701,0)
CONN-TH_2P-P2.50_HDGC2501WR-2P
  rect 1.524x1.524 hole 0.914: 1(-1.25,0)
  round 1.524 hole 0.914: 2(1.25,0)
DO-214AC_L4.3-W2.7-LS5.3-RD
  rect 1.999x1.999 smd: 1(-2.299,0) 2(2.301,0)
GC2400-TC010R
  rect 1.2x3.5 smd: 2(-3,-9.5) 3(-1,-9.5) 4(1,-9.5) 5(3,-9.5)
  rect 3.5x1.2 smd: 7(6.5,5.7) 8(-6.5,5.7)
HDR-TH_4P-P2.54-H-M-W9.4
  rect 1.8x1.8 hole 1.1: 1(-3.81,0)
  round 1.8 hole 1.1: 2(-1.27,0) 3(1.27,0) 4(3.81,0)
IND-SMD_L4.0-W4.0_0.47UH04209.5A
  rect 1.399x2.499 smd: 1(-1.9,0) 2(1.9,0)
LED0603-R-RD_GREEN
  rect 0.8x0.8 smd: 1(0.851,0) 2(-0.851,0)
LQFP-64_L10.0-W10.0-P0.50-LS12.0-BL
  oval 0.3x2 smd: 1(-3.75,-5.75) 2(-3.25,-5.75) 3(-2.75,-5.75) 4(-2.25,-5.75) 5(-1.75,-5.75) 6(-1.25,-5.75) 7(-0.75,-5.75) 8(-0.25,-5.75) 9(0.25,-5.75) 10(0.75,-5.75) 11(1.25,-5.75) 12(1.75,-5.75) 13(2.25,-5.75) 14(2.75,-5.75) 15(3.25,-5.75) 16(3.75,-5.75) 33(3.75,5.75) 34(3.25,5.75) 35(2.75,5.75) 36(2.25,5.75) 37(1.75,5.75) 38(1.25,5.75) 39(0.75,5.75) 40(0.25,5.75) 41(-0.25,5.75) 42(-0.75,5.75) 43(-1.25,5.75) 44(-1.75,5.75) 45(-2.25,5.75) 46(-2.75,5.75) 47(-3.25,5.75) 48(-3.75,5.75)
  oval 2x0.3 smd: 17(5.75,-3.75) 18(5.75,-3.25) 19(5.75,-2.75) 20(5.75,-2.25) 21(5.75,-1.75) 22(5.75,-1.25) 23(5.75,-0.75) 24(5.75,-0.25) 25(5.75,0.25) 26(5.75,0.75) 27(5.75,1.25) 28(5.75,1.75) 29(5.75,2.25) 30(5.75,2.75) 31(5.75,3.25) 32(5.75,3.75) 49(-5.75,3.75) 50(-5.75,3.25) 51(-5.75,2.75) 52(-5.75,2.25) 53(-5.75,1.75) 54(-5.75,1.25) 55(-5.75,0.75) 56(-5.75,0.25) 57(-5.75,-0.25) 58(-5.75,-0.75) 59(-5.75,-1.25) 60(-5.75,-1.75) 61(-5.75,-2.25) 62(-5.75,-2.75) 63(-5.75,-3.25) 64(-5.75,-3.75)
MFRC522mini
  round 1.8 hole 1.05: 1(-7.62,15.5) 2(-5.08,15.5) 3(-2.54,15.5) 4(0,15.5) 5(2.54,15.5) 6(5.08,15.5) 7(7.62,15.5)
PW2051
  rect 1.5x0.6 smd: 1(1.227,-0.95) 2(1.227,0) 3(1.227,0.95) 4(-1.227,0.95) 5(-1.227,-0.95)
PW4056
  oval 0.63x1.865 smd: 1(-1.905,-2.683) 2(-0.635,-2.683) 3(0.635,-2.683) 4(1.905,-2.683) 5(1.905,2.683) 6(0.635,2.683) 7(-0.635,2.683) 8(-1.905,2.683)
  rect 5.5x2.4 smd: 9(-0.889,0)
R0603
  rect 0.807x0.864 smd: 1(-0.754,0) 2(0.754,0)
SMA_L4.3-W2.6-LS5.2-RD
  rect 2x2 smd: 1(-2.2,0) 2(2.2,0)
SOIC-8_L5.3-W5.3-P1.27-LS8.0-BL
  oval 0.63x2.251 smd: 1(-1.905,-3.53) 2(-0.635,-3.53) 3(0.635,-3.53) 4(1.905,-3.53) 5(1.905,3.53) 6(0.635,3.53) 7(-0.635,3.53) 8(-1.905,3.53)
SOT-23-3_L2.9-W1.3-P1.90-LS2.4-BR
  rect 1.25x0.701 smd: 1(1.001,-0.95) 2(1.001,0.95) 3(-1.001,0)
SOT-23_L2.9-W1.3-P1.90-LS2.4-BR
  rect 1x0.8 smd: 1(1.15,-0.95) 2(1.15,0.95) 3(-1.15,0)
SW-SMD_4P-L5.1-W5.1-P3.70-LS6.5-TL-2
  rect 1.7x1 smd: 1(-3.3,1.849) 2(3.3,1.851) 3(-3.3,-1.851) 4(3.3,-1.851)
TYPE-C-SMD_TYPE-C-6P
  oval 1.1x1.9 hole 0.7x1.5: 7(-4.32,1.9) 7(-4.32,-1.9) 7(4.32,1.9) 7(4.32,-1.9)
  rect 0.7x1.8 smd: A5(-0.5,2.2) A9(1.5,2.2) B5(0.5,2.2) B9(-1.5,2.2)
  rect 0.8x1.8 smd: A12(2.7,2.2) B12(-2.7,2.2)
按钮开关
  round 1.8 hole 1.2: 1(-3.25,2.25) 2(3.25,2.25) 3(-3.25,-2.25) 4(3.25,-2.25)

## Nets
As in the schematic.

Pads without a net: U3 2 14 15 16 17 26 27 33 34 35 36 37 38 41 44 45 50 51 52 53 54 56 61 62; U4 1 7 8; USB1 7 A5 B5

## Via types
v1: diameter 1.6, hole 0.9, Top Layer to Bottom Layer, 5 vias
v2: diameter 1.27, hole 0.711, Top Layer to Bottom Layer, 9 vias
v3: diameter 0.61, hole 0.305, Top Layer to Bottom Layer, 57 vias

## Routing (per net, layer and track width the routed paths; a pad name or vN(x,y) marks a point on that pad's centre or on a via; arc(x,y) is an arc through that point)
+3.3V: length 353
  Top Layer w0.3: C12.2 23.29,29.35 C15.2 20.56,29.35 19.98,28.78 19.98,26.49 19.54,26.05 U3.13 ; v3(4.11,16.71) 3.47,17.35 3.47,17.98 5.54,20.05 U3.48 ; R7.2 37.63,19.12 v3(35.22,16.71) ; U3.1 19.31,20.05 20.49,18.87 v2(20.49,15.44) 19.92,16.02 C14.2 18.53,16.08 16.81,16.08 16.25,16.64 U3.64 ; 1.7,27.38 3.35,29.03 5.25,29.03 6.97,30.75 C16.2 8.05,31.06 8.75,30.36 U3.32 ; U3.19 15.25,31.66 15.92,32.33 17,32.33 C17.2
  Top Layer w0.5: 44.43,36.84 43.99,36.4 43.99,32.84 47.04,29.79 R1.2 ; U1.8 9.57,46.56 9.19,46.18 9.19,45.67 9.57,45.29 U1.7 14.08,45.29 C1.1 ; C20.1 52.06,44.03 R14.2 49.57,43.52 49.57,39.19 47.87,37.48 ; CN2.1 1.7,57.99 1.7,48.34 ; R8.1 v3(10.59,51.51) ; C17.2 17.25,32.9 18.33,33.98 28.24,33.98 v2(30.91,31.32) 30.65,31.06 24.3,31.06 23.47,30.24 C12.2
  Top Layer w0.7: 1.7,42.62 1.7,48.34 v2(3.22,49.86) ; 1.7,42.62 3.09,44.02 U1.3 ; 1.7,42.62 1.7,11 v1(2.2,10.49) ; 13.76,2.49 14.78,3.5 R20.1 ; 13.76,2.49 13.13,2.49 12.74,2.87 R19.1 ; 13.76,2.49 16.05,2.49 16.94,3.38 R21.1 18.47,5.04 19.73,6.3 19.73,8.97 v2(20.24,9.47) ; v2(15.92,46.05) 15.35,45.48 C1.1
  Top Layer w1: 47.87,37.48 47.23,36.84 C19.2 43.93,36.84 42.72,35.64 42.72,30.94 v1(43.22,30.43)
  Top Layer w1.2: v1(42.97,38.94) 43.54,38.94 C19.2
  Bottom Layer w0.3: v3(4.11,16.71) 3.73,16.33 3.73,14.68 4.62,13.79 ; v3(35.22,16.71) 33.67,15.16 33.67,14.81
  Bottom Layer w0.5: v2(20.49,15.44) 20.49,14.46 24.08,10.87 ; 8.37,49.86 10.02,51.51 v3(10.59,51.51)
  Bottom Layer w0.7: v2(20.24,9.47) 21.77,9.47 23.16,10.87 ; v1(43.22,30.43) 42.34,31.32 v2(30.91,31.32) ; v2(3.22,49.86) 13.25,49.86 15.92,47.19 v2(15.92,46.05)
  Bottom Layer w1: U2.7 36.62,61.03 38.65,59 38.65,54.3 36.62,52.27 36.62,45.29 v1(42.97,38.94) 38.65,38.94 37,37.29 32.94,37.29 31.54,38.68 31.54,41.96 31.5,42 ; v1(2.2,10.49) 1.95,10.74 1.95,13.16 2.58,13.79 11.86,13.79 14.78,10.87 29.73,10.87 33.67,14.81 39.41,14.81 42.97,18.36 42.97,23.06 45.51,25.6 45.51,29.03 44.11,30.43 v1(43.22,30.43)
+3.7V: length 76.8
  Top Layer w0.5: SW1.4 SW1.3 ; Q1.3 46.54,55.19 44.88,55.19 43.99,56.08 R3.2
  Top Layer w1: Q1.3 46.91,56.84 48.56,58.5 CN1.2
  Bottom Layer w0.5: CN1.2 52.26,57.33 53,56.59 54.65,56.59 56.05,55.19 56.05,27.05 SW1.3
  Bottom Layer w1: U4.5 43.1,60.91 42.34,61.67 C11.2 41.13,64.02 41.95,64.85 48.05,64.85 52.26,60.63 CN1.2
GND: length 98.9
  Top Layer w0.3: v3(25.19,31.95) 25.06,32.08 C17.1 18.59,32.01 18.59,31.32 18.33,31.06 16.05,31.06 15.75,30.77 U3.18 ; 21.25,27.95 21.25,26.75 20.06,25.55 U3.12 ; R10.1 16.67,15.07 15.75,15.99 U3.63 ; U3.31 9.25,31.26 7.22,33.29 C8.2 ; U3.47 4.52,20.55 3.47,19.51 v3(3.47,21.16)
  Top Layer w0.5: R6.1 7.16,37.54 ; C3.1 22.78,12.39 22.65,12.27 ; Q2.2 53.57,29.22 53.64,29.29 ; R10.1 18.53,14.55 C14.1 ; R18.1 7.92,13.28 ; C16.1 5.57,31.7 C8.2 ; C12.1 25,29.41 v2(28.49,29.41) ; U1.4 3.22,42.75 ; SW3.3 14.39,57.42 C10.1 ; R4.2 53,16.71 53.13,16.59 ; C5.2 29.76,18.87 ; C4.1 25.32,12.27 ; C7.2 29.76,26.62
  Top Layer w0.7: USB1.B12 26.3,3.85 25.7,3.25 23.54,3.25 ; USB1.A12 31.7,3.47 32.05,3.12 34.84,3.12 ; U6.2 54.02,49.73 ; C1.2 14.27,47.95
  Top Layer w1: C19.1 45.64,33.86 ; C2.1 48.12,41.04 48.05,40.97 ; R13.1 50.84,41.35 ; C18.1 48.3,47.19 ; SW3.4 SW3.3 ; Q3.2 45.7,60.21 ; R5.1 40.68,52.65
  Bottom Layer w0.5: C6.1 37,19.63 ; R11.1 42.97,50.37
  Bottom Layer w1: 33.06,57.1 33.17,57.2 35,57.2 ; v1(22.02,55.19) 22,55.21 22,57.2 ; U4.9 42.34,57.1 ; R12.1 48.69,67.51 ; 29.51,37.79 29.5,37.8 29.5,42 ; C9.1 39.98,51.76 38.65,51.76 ; C11.1 38.78,61.67 ; U4.3 44.37,52.91
  vias: v3(2.58,7.95) v3(4.36,39.7) v3(4.36,37.92) v3(4.36,36.14) v3(4.36,34.49) v3(4.36,32.84) v3(6.01,7.95) v3(6.78,40.59) v3(8.3,61.42) v3(8.93,40.59) v3(8.93,6.04) v3(8.93,2.11) v3(10.46,40.59) v3(11.35,67) v3(11.35,63.7) v3(26.46,31.95) v3(27.73,31.95) v3(30.78,46.81) v3(33.45,47.57) v3(34.21,45.29) v3(40.81,5.92) v3(40.81,2.36) v3(44.37,5.79) v3(44.49,2.36) v3(48.3,5.79) v3(48.3,2.36) v3(54.4,33.98) v3(54.4,32.08) v3(56.18,62.56)
VIN: length 18.3
  Top Layer w1: U6.4 48.55,50.68 C18.2 ; C18.2 48.3,50.88 47.86,51.32 Q1.2 ; C18.2 47.23,50.43 46.71,49.92 C2.2 46.21,41.48 44.35,41.48 D1.1
BAT_CHRG: length 16.5
  Top Layer w0.3: R18.2 5.38,13.27 R17.1 3.35,13.27 2.58,14.05 2.58,22.68 3.95,24.05 U3.40
BAT_DONE: length 77.8
  Top Layer w0.3: v3(42.97,63.07) 42.97,64.97 v3(44.24,66.24) ; v3(9.32,25.98) 9.32,25.48 8.39,24.55 U3.39 ; v3(38.53,63.83) 34.46,59.77 34.46,53.54 19.73,38.81 v3(16.05,38.81)
  Bottom Layer w0.3: v3(44.24,66.24) 44.24,67.5 R9.1 44.23,68.15 43.48,68.91 39.8,68.91 38.53,67.64 v3(38.53,63.83) ; U4.6 44.37,61.67 v3(42.97,63.07) ; v3(9.32,25.98) 9.32,33.1 15.03,38.81 v3(16.05,38.81)
  Bottom Layer w0.5: R12.2 R9.1
FLASH_CS: length 37.1
  Top Layer w0.3: U1.1 3.47,46.56 2.97,47.07 2.97,47.83 4.62,49.48 14.9,49.48 17.06,47.32 17.06,41.99 14.75,39.67 U3.20
FLASH_MISO: length 23.8
  Top Layer w0.3: v3(13.63,43) 13.75,42.88 U3.22 ; U1.2 6.14,45.29 v3(6.52,45.67)
  Bottom Layer w0.3: v3(13.63,43) 9.06,43 6.52,45.54 v3(6.52,45.67)
FLASH_MOSI: length 14.4
  Top Layer w0.3: U1.5 12.62,42.75 13.25,42.11 U3.23
FLASH_SCK: length 17.4
  Top Layer w0.3: U1.6 13.76,44.02 15.03,42.75 15.03,40.84 14.25,40.06 U3.21
KEY2: length 32.4
  Top Layer w0.3: U3.9 20.34,24.05 24.3,28.02 34.34,28.02 R7.1 36.11,26.23 36.11,25.22 35.14,24.25 SW2.1
  Bottom Layer w0.3: SW2.1 34.74,24.25 C6.2 39.27,24.25 SW2.2
KEY_ON: length 33.8
  Top Layer w0.3: v3(24.56,27.25) 20.85,23.55 U3.8 ; R1.1 47.8,28.4 v3(43.99,28.4)
  Top Layer w0.5: Q2.3 49.94,28.28 R1.1
  Bottom Layer w0.3: v3(43.99,28.4) 42.84,27.25 v3(24.56,27.25)
LED1: length 7.1
  Top Layer w0.3: 12.74,10.96 12.75,10.97 U3.57
LED2: length 7.9
  Top Layer w0.3: LED2.2 15,11.54 13.25,13.29 U3.58
LED3: length 9.2
  Top Layer w0.3: LED3.2 17.2,11.62 15.92,12.9 14.9,12.9 13.75,14.06 U3.59
NRST: length 52.1
  Top Layer w0.3: SW3.1 13.88,53.73 C10.2 15.28,52.41 R8.2 17.7,48.2 17.7,40.08 v3(17.57,39.95) ; U3.7 15.42,23.05 v3(11.86,26.62) ; SW3.2 12.99,53.72
  Bottom Layer w0.3: v3(17.57,39.95) 17.57,37.79 16.81,37.03 14.52,37.03 10.97,33.48 10.97,27.51 v3(11.86,26.62)
OSC32_IN: length 9.7
  Top Layer w0.3: U3.3 21.36,21.05 22.67,19.74 Y1.2 22.67,15.11 C3.2
OSC32_OUT: length 11.8
  Top Layer w0.3: U3.4 22.13,21.55 25.17,18.51 Y1.1 25.17,15.15 C4.2
OSC_IN: length 12.5
  Top Layer w0.3: C5.1 27.39,21.48 Y2.2 24.96,22.05 U3.5
OSC_OUT: length 12.6
  Top Layer w0.3: C7.1 26.97,24.14 Y2.1 24.36,22.55 U3.6
PWR_EN: length 46.8
  Top Layer w0.3: D3.2 v3(39.29,9.73) ; v3(10.59,11.38) 11.75,12.54 U3.55
  Bottom Layer w0.3: v3(10.59,11.38) 13.63,8.33 37.89,8.33 v3(39.29,9.73)
RC522_NSS: length 41.5
  Top Layer w0.3: U3.24 12.75,40.2 v3(11.98,40.97)
  Bottom Layer w0.3: U2.1 18.46,63.58 18.46,46.81 12.62,40.97 v3(11.98,40.97)
RC522_RST: length 46.7
  Top Layer w0.3: v3(11.98,33.1) 12.25,32.83 U3.25 ; v3(18.46,41.35) 31.54,54.43 U2.5
  Bottom Layer w0.3: v3(11.98,33.1) 14.52,33.1 18.46,37.03 v3(18.46,41.35)
RX1: length 34.7
  Top Layer w0.3: U3.43 10.71,22.55 11.35,23.19 v3(11.35,23.82)
  Bottom Layer w0.3: v3(11.35,23.82) 20.11,23.82 21.76,25.48 21.76,34.24 25.44,37.92 25.44,41.94 25.5,42
SPI2_MISO: length 52.2
  Top Layer w0.3: U3.10 16.72,24.55 15.16,26.11 v3(14.14,26.11)
  Bottom Layer w0.3: U2.4 29,54.18 19.73,44.91 19.73,35.89 16.05,32.21 16.05,26.49 15.67,26.11 v3(14.14,26.11)
SPI2_MOSI: length 49.7
  Top Layer w0.3: v3(14.14,26.87) 15.16,26.87 16.98,25.05 U3.11
  Bottom Layer w0.3: v3(14.14,26.87) 15.41,28.14 15.41,32.33 19.22,36.14 19.22,45.16 26.59,52.53 26.59,66.37 U2.3
SPI2_SCK: length 44.1
  Top Layer w0.3: U3.29 10.25,34.45 v3(9.82,34.87)
  Bottom Layer w0.3: v3(9.82,34.87) 9.82,37.16 25.32,52.65 25.32,62.56 23.92,63.96 U2.2
SW_EN: length 60.9
  Top Layer w0.5: D3.1 D2.1 55.29,13.28 56.05,14.05 56.05,51.64 55.04,52.65 54.4,52.65 54.53,52.78 v2(54.53,54.69) ; U6.1 53.7,48.78 54.15,48.34 54.15,47.45 53.77,47.07 v2(53.26,47.07)
  Bottom Layer w0.5: v2(54.53,54.69) 55.04,54.18 55.04,48.59 53.51,47.07 v2(53.26,47.07)
SWCLK: length 44
  Top Layer w0.3: v3(8.17,16.2) 8.75,16.78 U3.49
  Bottom Layer w0.3: v3(8.17,16.2) 8.17,19 2.08,25.09 2.08,53.92 2.84,54.69 CN2.3
SWDIO: length 40.6
  Top Layer w0.3: U3.46 4.98,21.05 v3(3.47,22.55)
  Bottom Layer w0.3: CN2.2 2.58,57.23 1.62,56.26 1.62,24.4 v3(3.47,22.55)
TX1: length 35.6
  Top Layer w0.3: U3.42 9.94,23.05 v3(10.33,23.44)
  Bottom Layer w0.3: 27.5,42 27.5,38.2 22.4,33.1 22.4,25.35 20.24,23.19 10.59,23.19 v3(10.33,23.44)
USB+: length 139.5
  Top Layer w0.5: 40.94,42.81 36.87,46.88 36.87,56.08 40.3,59.51 v2(40.3,66.75) ; R17.2 3.6,10.49 4.36,9.73 9.44,9.73 10.46,8.71 10.46,2.87 11.98,1.35 18.33,1.35 21.51,4.52 21.51,6.17 23.54,8.2 28.75,8.2 ; D1.2 44.11,46.57 44.24,46.7 R2.2
  Top Layer w0.7: 30.5,5.15 30.52,5.17 30.52,7.49 31.99,8.97 ; 27.5,5.15 27.48,5.17 27.48,6.94
  Top Layer w1: 40.94,45.29 40.94,48.21 v1(40.3,48.84)
  Top Layer w1.2: D1.2 41.97,46.32 40.94,45.29 40.94,29.54 42.84,27.63 42.84,16.97 34.84,8.97 29.51,8.97 27.48,6.94
  Bottom Layer w0.5: v2(40.3,66.75) 41.07,67.51 R9.2
  Bottom Layer w1: U4.4 43.1,52.65 42.34,51.89 C9.2 41.51,50.05 v1(40.3,48.84)
$1N1057: length 4.3
  Top Layer w0.3: U3.30 9.75,32.22 C8.1
$1N1061: length 4.2
  Top Layer w0.3: R10.2 14.65,14.55 14.25,14.95 U3.60
$1N1063: length 8.3
  Top Layer w0.3: U3.28 10.75,36.86 R6.2
$1N4310: length 4.3
  Top Layer w0.5: 45.96,53.56 45.96,53.23 45.38,52.65 R5.2 44.24,52.64 R2.1
$1N4312: length 3
  Top Layer w0.5: Q3.1 43.8,58.29 R3.1
$1N4317: length 13.1
  Top Layer w1: CN1.1 54.76,60.42 51.85,63.33 Q3.3
$1N5240: length 27
  Top Layer w0.5: D2.2 48.39,14.89 R4.1 47.8,16.71 46.75,17.76 SW1.2 SW1.1 54.78,21.28 54.78,26.75 54.21,27.32 Q2.1
$1N7608: length 4.1
  Bottom Layer w0.5: R11.2 45.64,50.37 U4.2
$1N18015: length 17.5
  Top Layer w0.7: L2.1 52.75,37.29 55.16,39.7 55.16,50.11 54.59,50.68 U6.3
$1N18018: length 12
  Top Layer w0.5: U6.5 50.76,48.53 50.76,46.21 R14.1 52.06,45.53 C20.2 52.18,45.54 53.26,45.54 54.02,44.78 54.02,41.73 53.64,41.35 R13.2
$1N20712: length 2.6
  Top Layer w0.3: LED1.1 12.74,9.09 R19.2
$1N20785: length 2.7
  Top Layer w0.3: R20.2 14.78,8.81 15,9.04 LED2.1
$1N20858: length 2.7
  Top Layer w0.3: R21.2 16.94,8.24 17.2,8.51 LED3.1

## Copper pours and planes (outline as drawn; the poured copper is in the pictures)
GND on Top Layer: -2.75,71.96 59.61,71.96 59.61,-1.96 -2.75,-1.96
GND on Bottom Layer: -2.75,71.96 59.61,71.96 59.61,-1.96 -2.75,-1.96
